# Altium schematic sheet BMSIOConnector.SchDoc
size A
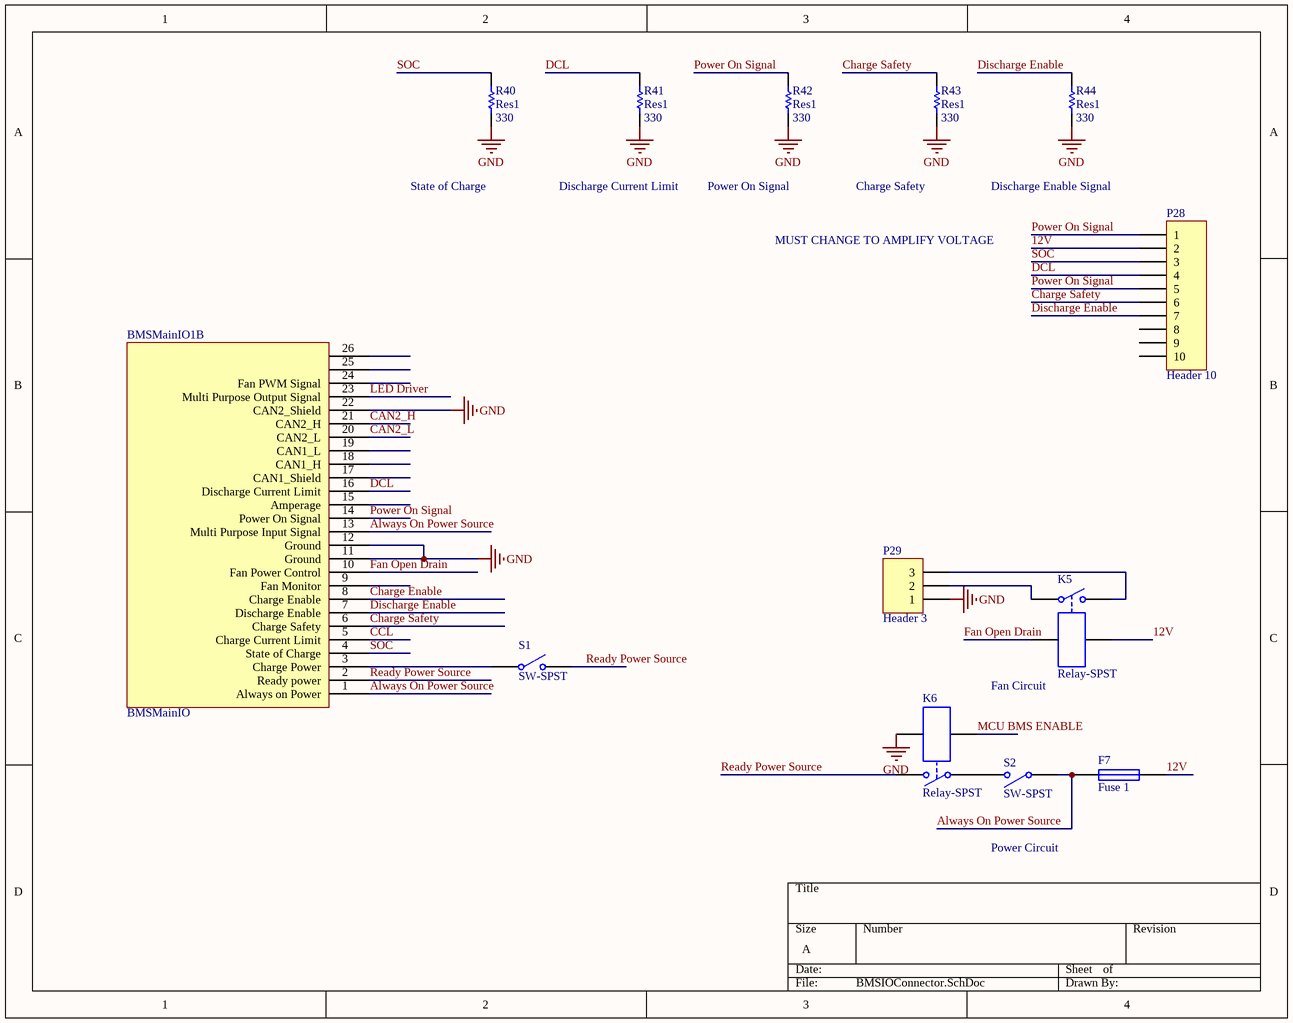
[diagram p0: BMSIOConnector.SchDoc]

## Parts
BMSMainIO1  BMSMainIO  (part B of 2)
F7  Fuse 1  [PIN-W2/E2.8]
K5  Relay-SPST  [MODULE4]
K6  Relay-SPST  [MODULE4]
P28  Header 10  [HDR1X10]
P29  Header 3  [HDR1X3]
R40  Res1  value 330  [AXIAL-0.3]
R41  Res1  value 330  [AXIAL-0.3]
R42  Res1  value 330  [AXIAL-0.3]
R43  Res1  value 330  [AXIAL-0.3]
R44  Res1  value 330  [AXIAL-0.3]
S1  SW-SPST  [SPST-2]
S2  SW-SPST  [SPST-2]

## Nets
GND: BMSMainIO1.11(Ground) BMSMainIO1.12(Ground) BMSMainIO1.22(CAN2_Shield) K6.4 P29.1 R40.2 R41.2 R42.2 R43.2 R44.2
12V: F7.2 K5.4 P28.2
Always On Power Source: BMSMainIO1.1(Always_on_Power) BMSMainIO1.13(Multi_Purpose_Input_Signal) F7.1 S2.1(COMMON)
CAN2_H: BMSMainIO1.21(CAN2_H)
CAN2_L: BMSMainIO1.20(CAN2_L)
CCL: BMSMainIO1.5(Charge_Current_Limit)
Charge Enable: BMSMainIO1.8(Charge_Enable)
Charge Safety: BMSMainIO1.6(Charge_Safety) P28.6 R43.1
DCL: BMSMainIO1.16(Discharge_Current_Limit) P28.4 R41.1
Discharge Enable: BMSMainIO1.7(Discharge_Enable) P28.7 R44.1
Fan Open Drain: BMSMainIO1.10(Fan_Power_Control) K5.3
LED Driver: BMSMainIO1.23(Multi_Purpose_Output_Signal)
MCU BMS ENABLE: K6.3
Power On Signal: BMSMainIO1.14(Power_On_Signal) P28.1 P28.5 R42.1
Ready Power Source: BMSMainIO1.2(Ready_power) K6.2 S1.2(NO)
SOC: BMSMainIO1.4(State_of_Charge) P28.3 R40.1
NetBMSMainIO1_3: BMSMainIO1.3(Charge_Power) S1.1(COMMON)
NetK5_1: K5.1 P29.2
NetK5_2: K5.2 P29.3
NetK6_1: K6.1 S2.2(NO)

Not connected (* = marked no-connect by the designer): BMSMainIO1 9(Fan_Monitor) 15(Amperage) 17(CAN1_Shield) 18(CAN1_H) 19(CAN1_L) 24(Fan_PWM_Signal) 25 26; P28 8 9 10

## Notes on the sheet
- State of Charge
- Discharge Current Limit
- Power On Signal
- Charge Safety
- Discharge Enable Signal
- MUST CHANGE TO AMPLIFY VOLTAGE
- Fan Circuit
- Power Circuit

## Library data of the parts
F7 = Fuse 1: Fuse; Published: 8-Jun-2000; LatestRevisionDate: 17-Jul-2002; LatestRevisionNote: Re-released for DXP Platform.; PackageReference: PIN-W2/E2.8; Publisher: Altium Limited; PackageDescription: Thru-Hole; 2 Leads
K5 K6 = Relay-SPST: Single-Pole Single-Throw Relay; Published: 24-Mar-1999; LatestRevisionDate: 17-Jul-2002; LatestRevisionNote: Re-released for DXP Platform.; PackageReference: MODULE4; Publisher: Altium Limited
P28 = Header 10: Header, 10-Pin; LatestRevisionDate: 17-Jul-2002; LatestRevisionNote: Re-released for DXP Platform.; Publisher: Altium Limited
P29 = Header 3: Header, 3-Pin; LatestRevisionDate: 17-Jul-2002; LatestRevisionNote: Re-released for DXP Platform.; Publisher: Altium Limited
R40-R44 = Res1: Resistor; Published: 8-Jun-2000; LatestRevisionDate: 17-Jul-2002; LatestRevisionNote: Re-released for DXP Platform.; PackageReference: AXIAL-0.3; Publisher: Altium Limited; PackageDescription: Axial Device, Thru-Hole; 2 Leads; 0.3 in Pin Spacing
S1 S2 = SW-SPST: Single-Pole, Single-Throw Switch; Published: 24-Mar-1999; LatestRevisionDate: 17-Jul-2002; LatestRevisionNote: Re-released for DXP Platform.; PackageReference: SPST-2; Publisher: Altium Limited; PackageDescription: Switch; 2 Leads